# Altium schematic sheet Sheet1.SchDoc
size A
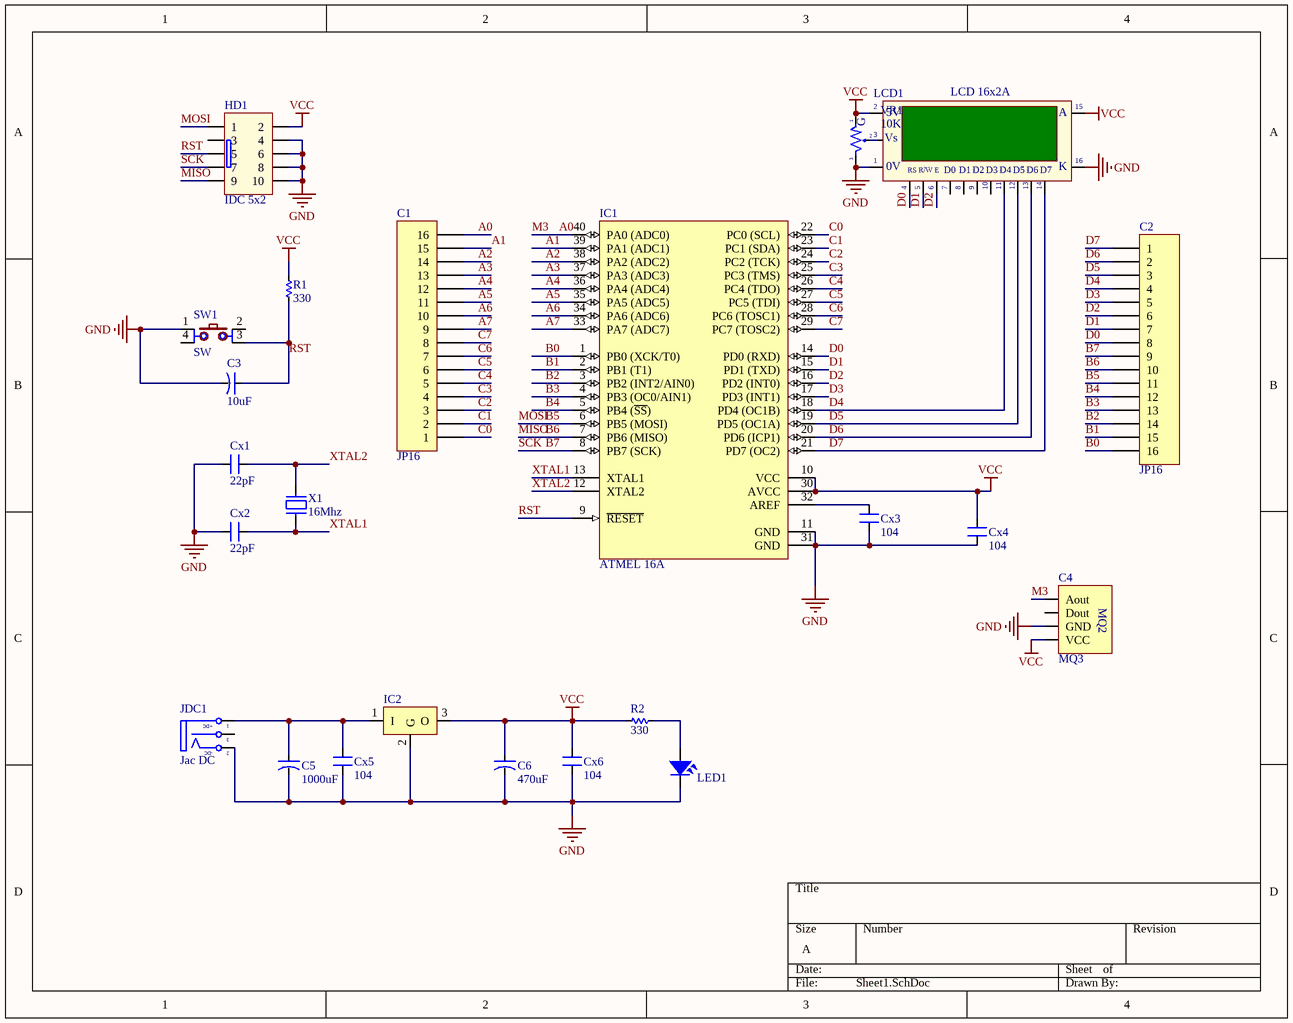
[diagram p0: Sheet1.SchDoc]

## Parts
C1  JP16  [JP16-D1T]
C2  JP16  [JP16-D1T]
C3  10uF  [CA-ALU-2.54]
C4  MQ3  [MQ2-MODULE]
C5  1000uF  [CA-ALU-2.54]
C6  470uF  [CA-ALU-2.54]
Cx1  22pF  [CN1]
Cx2  22pF  [CN1]
Cx3  104  [CN1]
Cx4  104  [CN1]
Cx5  104  [CN1]
Cx6  104  [CN1]
HD1  IDC 5x2  [IDC10]
IC1  ATMEL 16A  [DIP40/W0.6]
IC2  LM78xx  [TO220-123]  (value not drawn)
JDC1  Jac DC  [DC0]
LCD1  LCD 16x2A  [LCD16X2N]
LED1  LED  [LED-3MM-RED]  (value not drawn)
R1  330  [RES-1/4W-SMALL]
R2  330  [RES-1/4W-SMALL]
SW1  SW  [SW2-DIP]
VR1  10K  [VR-S2]
X1  16Mhz  [XT2]

## Nets
GND: C3.2 C4.3(GND) C5.2 C6.2 Cx1.1 Cx2.1 Cx3.1 Cx4.1 Cx5.1 Cx6.1 HD1.4 HD1.6 HD1.8 HD1.10 IC1.11(GND) IC1.31(GND) IC2.2(G) JDC1.2(TN) LCD1.1(GND) LCD1.16(K) LED1.2 SW1.1 VR1.3
VCC: C4.4(VCC) C6.1 Cx4.2 Cx6.2 HD1.2 IC1.10(VCC) IC1.30(AVCC) IC2.3(O) LCD1.2(VDD) LCD1.15(A) R1.2 R2.2 VR1.1
A0: C1.16 C4.1(Aout) IC1.40(PA0_(ADC0))  [also labelled M3]
A1: C1.15 IC1.39(PA1_(ADC1))
A2: C1.14 IC1.38(PA2_(ADC2))
A3: C1.13 IC1.37(PA3_(ADC3))
A4: C1.12 IC1.36(PA4_(ADC4))
A5: C1.11 IC1.35(PA5_(ADC5))
A6: C1.10 IC1.34(PA6_(ADC6))
A7: C1.9 IC1.33(PA7_(ADC7))
B0: C2.16 IC1.1(PB0_(XCK/T0))
B1: C2.15 IC1.2(PB1_(T1))
B2: C2.14 IC1.3(PB2_(INT2/AIN0))
B3: C2.13 IC1.4(PB3_(OC0/AIN1))
B4: C2.12 IC1.5(PB4_(~{SS}))
B5: C2.11 HD1.1 IC1.6(PB5_(MOSI))  [also labelled MOSI]
B6: C2.10 HD1.9 IC1.7(PB6_(MISO))  [also labelled MISO]
B7: C2.9 HD1.7 IC1.8(PB7_(SCK))  [also labelled SCK]
C0: C1.1 IC1.22(PC0_(SCL))
C1: C1.2 IC1.23(PC1_(SDA))
C2: C1.3 IC1.24(PC2_(TCK))
C3: C1.4 IC1.25(PC3_(TMS))
C4: C1.5 IC1.26(PC4_(TDO))
C5: C1.6 IC1.27(PC5_(TDI))
C6: C1.7 IC1.28(PC6_(TOSC1))
C7: C1.8 IC1.29(PC7_(TOSC2))
D0: C2.8 IC1.14(PD0_(RXD)) LCD1.4(RS)
D1: C2.7 IC1.15(PD1_(TXD)) LCD1.5(R/~{W})
D2: C2.6 IC1.16(PD2_(INT0)) LCD1.6(~{EN})
D3: C2.5 IC1.17(PD3_(INT1))
D4: C2.4 IC1.18(PD4_(OC1B)) LCD1.11(D4)
D5: C2.3 IC1.19(PD5_(OC1A)) LCD1.12(D5)
D6: C2.2 IC1.20(PD6_(ICP1)) LCD1.13(D6)
D7: C2.1 IC1.21(PD7_(OC2)) LCD1.14(D7)
RST: C3.1 HD1.5 IC1.9(~{RESET}) R1.1 SW1.3
XTAL1: Cx2.2 IC1.13(XTAL1) X1.1
XTAL2: Cx1.2 IC1.12(XTAL2) X1.2
NetC5_1: C5.1 Cx5.2 IC2.1(I) JDC1.1(T)
NetCx3_2: Cx3.2 IC1.32(AREF)
NetLCD1_3: LCD1.3(VEE) VR1.2
NetLED1_1: LED1.1 R2.1

Not connected (* = marked no-connect by the designer): C4 2(Dout); HD1 3; JDC1 3(S); LCD1 7(D0) 8(D1) 9(D2) 10(D3); SW1 2 4

## Notes on the sheet
- (in symbol DCIN) +DC; -DC
- (in symbol LCD16x2A) 5V; Vs; |; 0V; R/W; E
- (in symbol MQ2-MOD) MQ2
- (in symbol VR-S) G

## Library data of the parts
C1 C2 = JP16: WR-PHD 2.54 mm Angled Socket Header; Manufacturer: W¨¹rth Elektronik eiSos GmbH; partNo: 613016143121; ComponentLink1 Description: Manufacturer; ComponentLink2 Description: Datasheet; NoPins: 16; Created Date: 29 March 2013; ComponentLink1URL: http://www.we-online.com; ComponentLink2URL: http://katalog.we-online.de/em/datasheet/6130xx143121.pdf; Created by: Karrer Zheng
C3 C5 C6 = CN-ALU-DIP: Capacitor (Semiconductor SIM Model); Value: 104; LatestRevisionDate: 17-Jul-2002; LatestRevisionNote: Re-released for DXP Platform.; PackageReference: C1206; Publisher: Altium Limited
C4 = MQ2-MOD: Manufacturer: W¨¹rth Elektronik eiSos GmbH; partNo: 613004143121; ComponentLink1 Description: Manufacturer; ComponentLink2 Description: Datasheet; NoPins: 04; Created Date: 29 March 2013; ComponentLink1URL: http://www.we-online.com; ComponentLink2URL: http://katalog.we-online.de/em/datasheet/6130xx143121.pdf; Created by: Karrer Zheng
Cx1-Cx6 = CN: Value: 33pF
HD1 = IDC 5X2: Value: Header 5x2
IC1 = ATmega16A-PU: 8-Bit AVR Microcontroller with 16K Bytes of In-System Programmable Flash Memory; Value: Atmega 16L
IC2 = LM78xx: Positive Voltage Regulator; Note: Tab is connected to pin 3 (GND).; Published: 24-Aug-2001; LatestRevisionDate: 17-Jul-2002; LatestRevisionNote: Re-released for DXP Platform.; DatasheetVersion: Apr-1994; PackageVersion: Jul-1998; PackageReference: ISOWATT220AB; Publisher: Altium Limited; PackageDescription: TO, Thru-Hole, Vertical, Heatsink Mounted; 3 In-Line Leads; Pitch 2.54 mm; Pin sequence 1, 3, 2; ComponentLink1Description: Manufacturer Link; ComponentLink1URL: http://www.st.com/; ComponentLink2Description: Datasheet; ComponentLink2URL: http://www.st.com/stonline/products/literature/ds/2146/l78m05c.pdf
JDC1 = DCIN: Jac DC input; Value: Jac DC
LCD1 = LCD16x2A: LCD dipslay 16 char, 2 line; Value: LCD16x2A; Parameter 1: *
LED1 = LED: LED Single colour Green and Red; Value: LED 3 ly Single Colour
R1 R2 = Res: Manufacturer: Generic Components; Class: Passive; SubClass: R; Published: 08/06/2000; Publisher: Altium Hobart Technology Centre
SW1 = SW4: Switch button 4 pin; Value: Button chip 4 pin
VR1 = VR-S: Var Resistor; Value: Volume 50k; Parameter 1: Volume 100k
X1 = XT2: Crystal, 32.768 KHz, -40 to 85 degC, 3.2 x 1.5 x 0.9 mm SMD; Value: 4Mhz